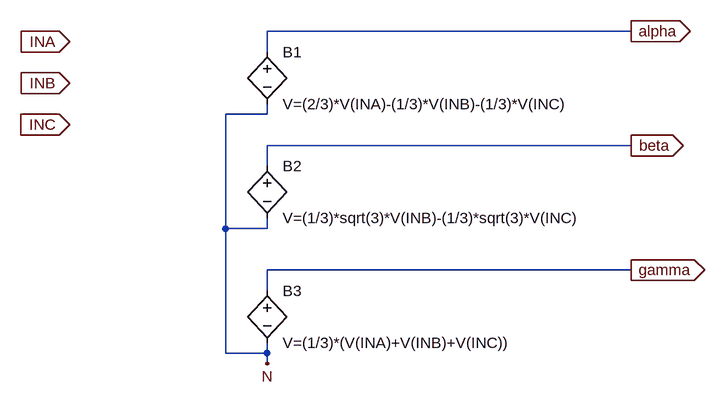
[diagram p0: schematic test1.asc]
test1.asc, the LTspice schematic file:
Version 4
SHEET 1 880 680
WIRE 736 -80 176 -80
WIRE 176 -48 176 -80
WIRE 176 48 176 32
WIRE 176 48 112 48
WIRE 736 96 176 96
WIRE 176 128 176 96
WIRE 112 224 112 48
WIRE 176 224 176 208
WIRE 176 224 112 224
WIRE 736 288 176 288
WIRE 176 320 176 288
WIRE 112 416 112 224
WIRE 176 416 176 400
WIRE 176 416 112 416
WIRE 176 432 176 416
FLAG -128 -64 INA
IOPIN -128 -64 In
FLAG -128 0 INB
IOPIN -128 0 In
FLAG -128 64 INC
IOPIN -128 64 In
FLAG 736 -80 alpha
IOPIN 736 -80 Out
FLAG 736 96 beta
IOPIN 736 96 Out
FLAG 736 288 gamma
IOPIN 736 288 Out
FLAG 176 432 N
SYMBOL bv 176 -64 R0
SYMATTR InstName B1
SYMATTR Value V=(2/3)*V(INA)-(1/3)*V(INB)-(1/3)*V(INC)
SYMBOL bv 176 112 R0
SYMATTR InstName B2
SYMATTR Value V=(1/3)*sqrt(3)*V(INB)-(1/3)*sqrt(3)*V(INC)
SYMBOL bv 176 304 R0
SYMATTR InstName B3
SYMATTR Value V=(1/3)*(V(INA)+V(INB)+V(INC))

The netlist it stands for:
* test1.asc
B1 alpha N V=(2/3)*V(INA)-(1/3)*V(INB)-(1/3)*V(INC)
B2 beta N V=(1/3)*sqrt(3)*V(INB)-(1/3)*sqrt(3)*V(INC)
B3 gamma N V=(1/3)*(V(INA)+V(INB)+V(INC))
.backanno
.end